# Altium schematic sheet TimedCircuit.SchDoc
size A
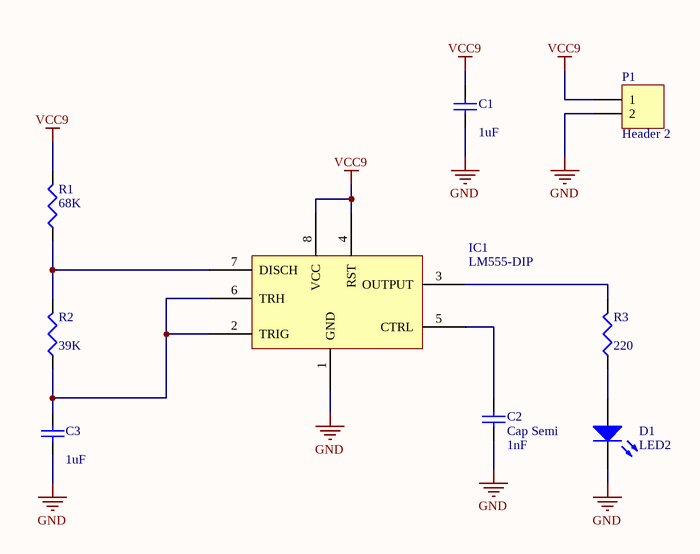
[diagram p0: TimedCircuit.SchDoc]

## Parts
C1  value 1uF  [1608[0603]]  (hidden comment: Cap Semi)
C2  Cap Semi  value 1nF  [1608[0603]]
C3  value 1uF  [1608[0603]]  (hidden comment: Cap Semi)
D1  LED2  [3.2X1.6X1.1]
IC1  LM555-DIP  [DIP-LM555]
P1  Header 2  [HDR1X2]
R1  value 68K  [J1-0603]  (hidden comment: Res3)
R2  value 39K  [J1-0603]  (hidden comment: Res3)
R3  value 220  [J1-0603]  (hidden comment: Res3)

## Nets
GND: C1.1 C2.1 C3.1 D1.2(K) IC1.1(GND) P1.2
VCC9: C1.2 IC1.4(RST) IC1.8(VCC) P1.1 R1.2
NetC2_2: C2.2 IC1.5(CTRL)
NetC3_2: C3.2 IC1.2(TRIG) IC1.6(TRH) R2.1
NetD1_1: D1.1(A) R3.1
NetIC1_3: IC1.3(OUTPUT) R3.2
NetIC1_7: IC1.7(DISCH) R1.1 R2.2

## Library data of the parts
C1-C3 = Cap Semi: Capacitor (Semiconductor SIM Model); Published: 8-Jun-2000; LatestRevisionDate: 29-May-2009; LatestRevisionNote: IPC-7351 Footprint Added.; PackageReference: C1206; Publisher: Altium Limited; PackageDescription: Chip Capacitor
D1 = LED2: Typical RED, GREEN, YELLOW, AMBER GaAs LED; Published: 8-Jun-2000; LatestRevisionDate: 17-Jul-2002; LatestRevisionNote: Re-released for DXP Platform.; PackageVersion: Feb-2002; PackageReference: 3.2X1.6X1.1; Publisher: Altium Limited; PackageDescription: SM LED; 2 Flat Leads
IC1 = LM555-DIP: LM555 DIP
P1 = Header 2: Header, 2-Pin; LatestRevisionDate: 17-Jul-2002; LatestRevisionNote: Re-released for DXP Platform.; Publisher: Altium Limited
R1-R3 = Res3: Resistor; Published: 8-Jun-2000; LatestRevisionDate: 29-May-2009; LatestRevisionNote: IPC-7351 Footprint Added.; PackageReference: J1-0603; Publisher: Altium Limited; PackageDescription: Chip Resistor